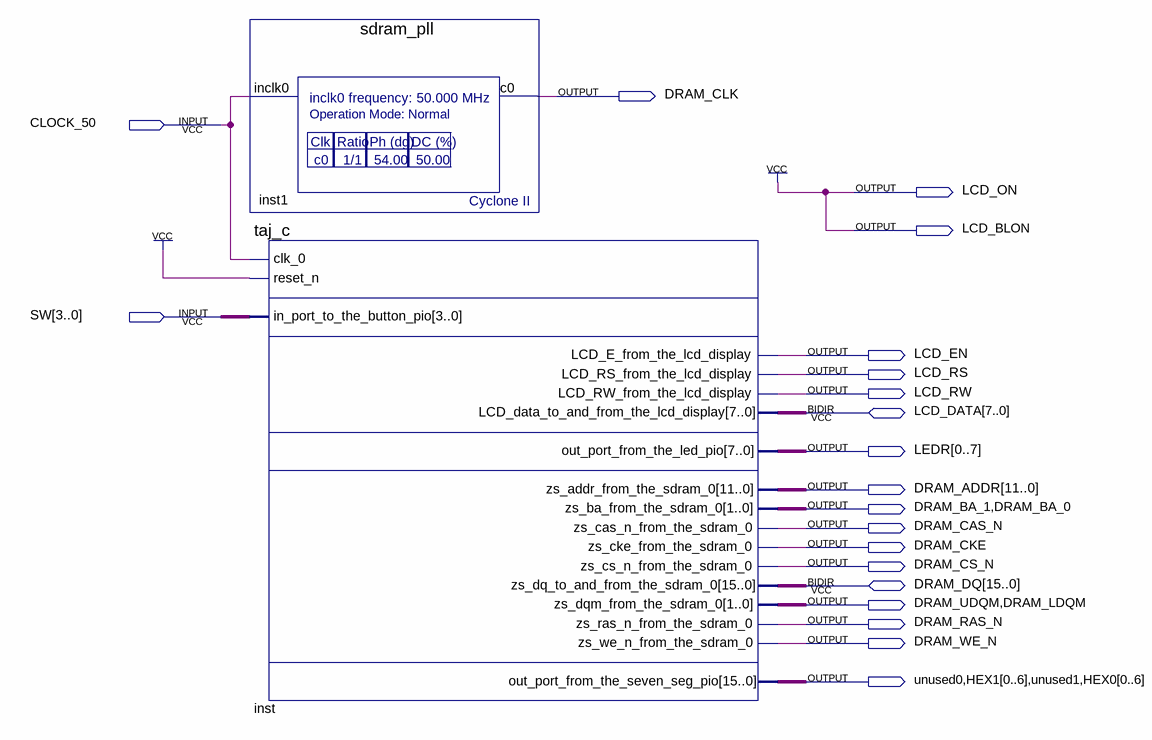
[diagram p0: schematic sheet]
// Quartus schematic lab1b.bdf as structural Verilog: 2 symbols, 20 pins
module lab1b (
  input  CLOCK_50,
  input  [3:0] SW,
  inout  [7:0] LCD_DATA,
  inout  [15:0] DRAM_DQ,
  output DRAM_CLK,
  output LCD_ON,
  output LCD_BLON,
  output LCD_EN,
  output LCD_RS,
  output LCD_RW,
  output [0:7] LEDR,
  output [11:0] DRAM_ADDR,
  output DRAM_BA_1,
  output DRAM_BA_0,
  output DRAM_CAS_N,
  output DRAM_CKE,
  output DRAM_CS_N,
  output DRAM_UDQM,
  output DRAM_LDQM,
  output DRAM_RAS_N,
  output DRAM_WE_N,
  output unused0,
  output [6:0] HEX1,
  output unused1,
  output [6:0] HEX0
);

  sdram_pll inst1 (.inclk0(CLOCK_50), .c0(DRAM_CLK));
  taj_c inst (
    .clk_0(CLOCK_50), .reset_n(1'b1), .in_port_to_the_button_pio(SW), .LCD_E_from_the_lcd_display(LCD_EN),
    .LCD_RS_from_the_lcd_display(LCD_RS), .LCD_RW_from_the_lcd_display(LCD_RW),
    .out_port_from_the_led_pio(LEDR), .zs_addr_from_the_sdram_0(DRAM_ADDR),
    .zs_ba_from_the_sdram_0({DRAM_BA_1, DRAM_BA_0}), .zs_cas_n_from_the_sdram_0(DRAM_CAS_N),
    .zs_cke_from_the_sdram_0(DRAM_CKE), .zs_cs_n_from_the_sdram_0(DRAM_CS_N),
    .zs_dqm_from_the_sdram_0({DRAM_UDQM, DRAM_LDQM}), .zs_ras_n_from_the_sdram_0(DRAM_RAS_N),
    .zs_we_n_from_the_sdram_0(DRAM_WE_N),
    .out_port_from_the_seven_seg_pio({unused0, HEX1[0], HEX1[1], HEX1[2], HEX1[3], HEX1[4], HEX1[5], HEX1[6], unused1, HEX0[0], HEX0[1], HEX0[2], HEX0[3], HEX0[4], HEX0[5], HEX0[6]}),
    .LCD_data_to_and_from_the_lcd_display(LCD_DATA), .zs_dq_to_and_from_the_sdram_0(DRAM_DQ));

  assign LCD_BLON = 1'b1;
  assign LCD_ON = 1'b1;
endmodule
